# EAGLE design maho-dac (EAGLE 4.16)
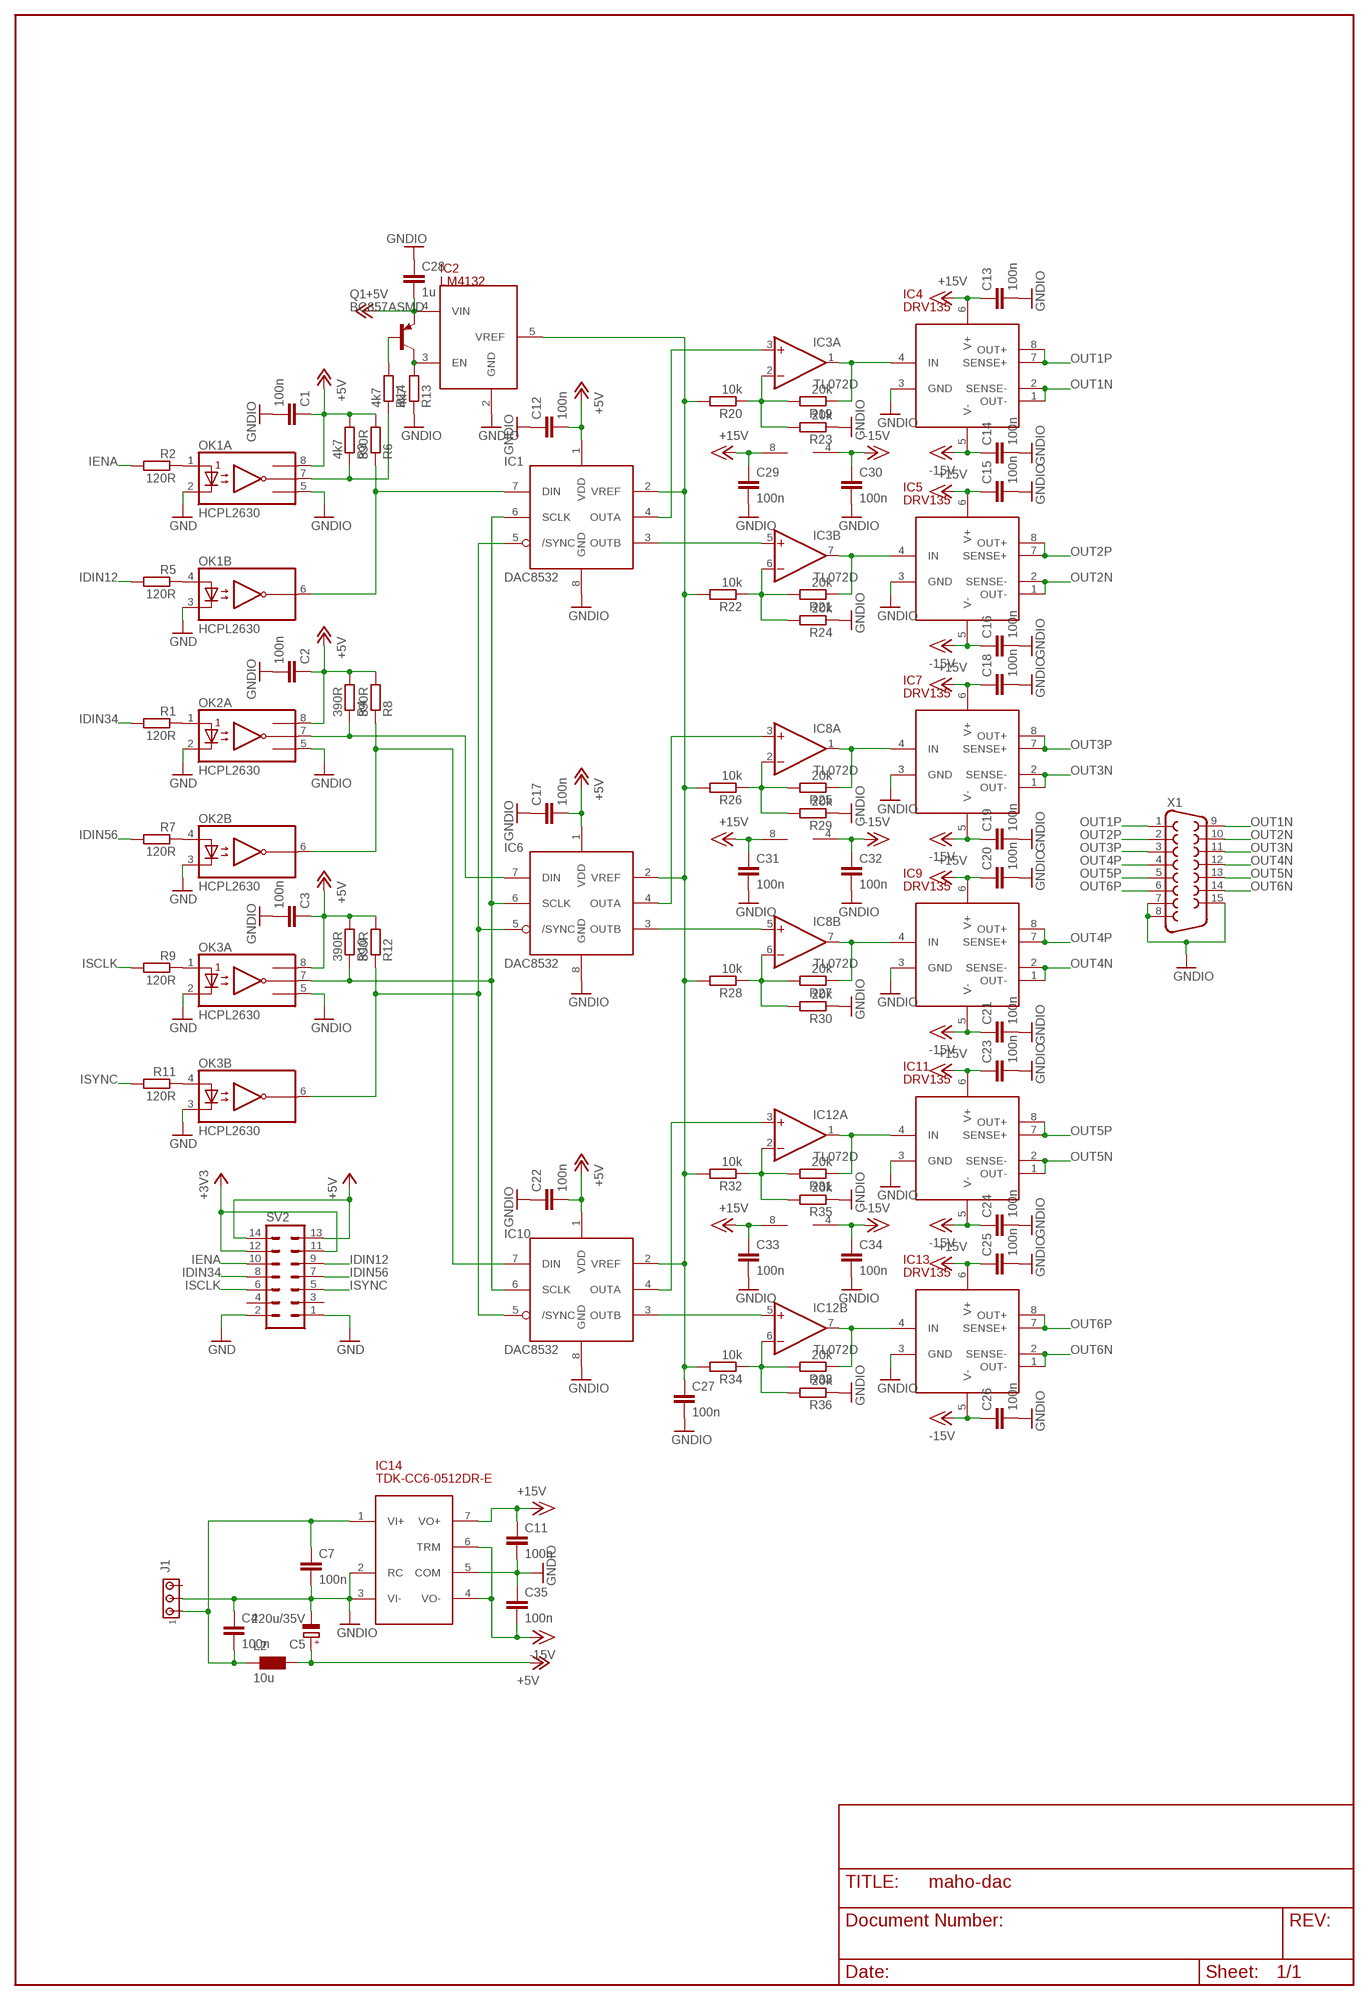
[diagram p0: schematic, sheet 1]

## Parts
C1  100n  C-EUC0603  [C0603]
C2  100n  C-EUC0603  [C0603]
C3  100n  C-EUC0603  [C0603]
C4  100n  C-EUC0603  [C0603]
C5  220u/35V  CPOL-EUF  [PANASONIC_F]
C7  100n  C-EUC0603  [C0603]
C11  100n  C-EUC0603  [C0603]
C12  100n  C-EUC0603  [C0603]
C13  100n  C-EUC0603  [C0603]
C14  100n  C-EUC0603  [C0603]
C15  100n  C-EUC0603  [C0603]
C16  100n  C-EUC0603  [C0603]
C17  100n  C-EUC0603  [C0603]
C18  100n  C-EUC0603  [C0603]
C19  100n  C-EUC0603  [C0603]
C20  100n  C-EUC0603  [C0603]
C21  100n  C-EUC0603  [C0603]
C22  100n  C-EUC0603  [C0603]
C23  100n  C-EUC0603  [C0603]
C24  100n  C-EUC0603  [C0603]
C25  100n  C-EUC0603  [C0603]
C26  100n  C-EUC0603  [C0603]
C27  100n  C-EUC0603  [C0603]
C28  1u  C-EUC0603  [C0603]
C29  100n  C-EUC0603  [C0603]
C30  100n  C-EUC0603  [C0603]
C31  100n  C-EUC0603  [C0603]
C32  100n  C-EUC0603  [C0603]
C33  100n  C-EUC0603  [C0603]
C34  100n  C-EUC0603  [C0603]
C35  100n  C-EUC0603  [C0603]
IC1  DAC8532  [MSOP8]
IC2  LM4132  [SOT23-5]
IC3  TL072D  [SO08]
IC4  DRV135  [SO08]
IC5  DRV135  [SO08]
IC6  DAC8532  [MSOP8]
IC7  DRV135  [SO08]
IC8  TL072D  [SO08]
IC9  DRV135  [SO08]
IC10  DAC8532  [MSOP8]
IC11  DRV135  [SO08]
IC12  TL072D  [SO08]
IC13  DRV135  [SO08]
IC14  TDK-CC6-0512DR-E  DCDC-TDK-CC6  [DCDC-TDK-CC6]
J1  MTA03-100  [10X03MTA]
L2  10u  WE-HC_744312...  [WE-HC_744312...]
OK1  HCPL2630  [DIL08]
OK2  HCPL2630  [DIL08]
OK3  HCPL2630  [DIL08]
Q1  BC857ASMD  [SOT23-BEC]
R1  120R  R-EU_R0805  [R0805]
R2  120R  R-EU_R0805  [R0805]
R3  4k7  R-EU_R0805  [R0805]
R4  390R  R-EU_R0805  [R0805]
R5  120R  R-EU_R0805  [R0805]
R6  390R  R-EU_R0805  [R0805]
R7  120R  R-EU_R0805  [R0805]
R8  390R  R-EU_R0805  [R0805]
R9  120R  R-EU_R0805  [R0805]
R10  390R  R-EU_R0805  [R0805]
R11  120R  R-EU_R0805  [R0805]
R12  390R  R-EU_R0805  [R0805]
R13  4k7  R-EU_R0805  [R0805]
R14  4k7  R-EU_R0805  [R0805]
R19  20k  R-EU_R0805  [R0805]
R20  10k  R-EU_R0805  [R0805]
R21  20k  R-EU_R0805  [R0805]
R22  10k  R-EU_R0805  [R0805]
R23  20k  R-EU_R0805  [R0805]
R24  20k  R-EU_R0805  [R0805]
R25  20k  R-EU_R0805  [R0805]
R26  10k  R-EU_R0805  [R0805]
R27  20k  R-EU_R0805  [R0805]
R28  10k  R-EU_R0805  [R0805]
R29  20k  R-EU_R0805  [R0805]
R30  20k  R-EU_R0805  [R0805]
R31  20k  R-EU_R0805  [R0805]
R32  10k  R-EU_R0805  [R0805]
R33  20k  R-EU_R0805  [R0805]
R34  10k  R-EU_R0805  [R0805]
R35  20k  R-EU_R0805  [R0805]
R36  20k  R-EU_R0805  [R0805]
SV2  ML14  [ML14]
X1  F15HP  [F15HP]

## Nets
+3V3: SV2.11 SV2.12
+5V: SV2.13 SV2.14
+12V: C1.1 C2.1 C3.1 C5.+ C12.2 C17.2 C22.2 C28.2 IC1.1(VDD) IC2.4(VIN) IC6.1(VDD) IC10.1(VDD) L2.2 OK1.8(A:VCC) OK2.8(A:VCC) OK3.8(A:VCC) Q1.E R3.2 R4.2 R6.2 R8.2 R10.2 R12.2 ; supply symbol labelled +5V
+15V: C11.1 C13.1 C15.1 C18.1 C20.1 C23.1 C25.1 C29.1 C31.1 C33.1 IC3.8(P:V+) IC4.6(V+) IC5.6(V+) IC7.6(V+) IC8.8(P:V+) IC9.6(V+) IC11.6(V+) IC12.8(P:V+) IC13.6(V+) IC14.7(VO+)
-15V: C14.1 C16.1 C19.1 C21.1 C24.1 C26.1 C30.1 C32.1 C34.1 C35.2 IC3.4(P:V-) IC4.5(V-) IC5.5(V-) IC7.5(V-) IC8.4(P:V-) IC9.5(V-) IC11.5(V-) IC12.4(P:V-) IC13.5(V-) IC14.4(VO-) IC14.6(TRM)
GND: OK1.2(A:C1) OK1.3(B:C2) OK2.2(A:C1) OK2.3(B:C2) OK3.2(A:C1) OK3.3(B:C2) SV2.1 SV2.2
GNDIO: C1.2 C2.2 C3.2 C4.1 C5.- C7.2 C11.2 C12.1 C13.2 C14.2 C15.2 C16.2 C17.1 C18.2 C19.2 C20.2 C21.2 C22.1 C23.2 C24.2 C25.2 C26.2 C27.2 C28.1 C29.2 C30.2 C31.2 C32.2 C33.2 C34.2 C35.1 IC1.8(GND) IC2.2(GND) IC4.3(GND) IC5.3(GND) IC6.8(GND) IC7.3(GND) IC9.3(GND) IC10.8(GND) IC11.3(GND) IC13.3(GND) IC14.2(RC) IC14.3(VI-) IC14.5(COM) J1.2 OK1.5(A:GND) OK2.5(A:GND) OK3.5(A:GND) R13.1 R23.1 R24.1 R29.1 R30.1 R35.1 R36.1 X1.7 X1.8 X1.15
IDIN12: R5.2 SV2.9
IDIN34: R1.2 SV2.8
IDIN56: R7.2 SV2.7
IENA: R2.2 SV2.10
ISCLK: R9.2 SV2.6
ISYNC: R11.2 SV2.5
N$1: IC1.7(DIN) OK1.6(B:VO2) R6.1
N$2: OK1.7(A:VO1) R3.1 R14.1
N$3: OK1.4(B:A2) R5.1
N$4: OK1.1(A:A1) R2.1
N$5: OK2.4(B:A2) R7.1
N$6: OK2.1(A:A1) R1.1
N$7: C4.2 C7.1 IC14.1(VI+) J1.1 L2.1
N$8: IC1.4(OUTA) IC3.3(A:+IN)
N$9: IC1.3(OUTB) IC3.5(B:+IN)
N$10: IC3.2(A:-IN) R19.2 R20.1 R23.2
N$11: IC3.1(A:OUT) IC4.4(IN) R19.1
N$12: C27.1 IC1.2(VREF) IC2.5(VREF) IC6.2(VREF) IC10.2(VREF) R20.2 R22.2 R26.2 R28.2 R32.2 R34.2
N$13: IC3.6(B:-IN) R21.2 R22.1 R24.2
N$14: IC3.7(B:OUT) IC5.4(IN) R21.1
N$17: IC10.7(DIN) OK2.6(B:VO2) R8.1
N$18: IC6.4(OUTA) IC8.3(A:+IN)
N$19: IC6.7(DIN) OK2.7(A:VO1) R4.1
N$20: OK3.4(B:A2) R11.1
N$21: IC6.3(OUTB) IC8.5(B:+IN)
N$22: IC8.2(A:-IN) R25.2 R26.1 R29.2
N$23: IC7.4(IN) IC8.1(A:OUT) R25.1
N$24: IC2.3(EN) Q1.C R13.2
N$25: IC8.6(B:-IN) R27.2 R28.1 R30.2
N$26: IC8.7(B:OUT) IC9.4(IN) R27.1
N$27: OK3.1(A:A1) R9.1
N$28: IC1.5(/SYNC) IC6.5(/SYNC) IC10.5(/SYNC) OK3.6(B:VO2) R12.1
N$29: IC1.6(SCLK) IC6.6(SCLK) IC10.6(SCLK) OK3.7(A:VO1) R10.1
N$30: Q1.B R14.2
N$31: IC10.4(OUTA) IC12.3(A:+IN)
N$32: IC10.3(OUTB) IC12.5(B:+IN)
N$33: IC12.2(A:-IN) R31.2 R32.1 R35.2
N$34: IC11.4(IN) IC12.1(A:OUT) R31.1
N$36: IC12.6(B:-IN) R33.2 R34.1 R36.2
N$37: IC12.7(B:OUT) IC13.4(IN) R33.1
OUT1N: IC4.1(OUT-) IC4.2(SENSE-) X1.9
OUT1P: IC4.7(SENSE+) IC4.8(OUT+) X1.1
OUT2N: IC5.1(OUT-) IC5.2(SENSE-) X1.10
OUT2P: IC5.7(SENSE+) IC5.8(OUT+) X1.2
OUT3N: IC7.1(OUT-) IC7.2(SENSE-) X1.11
OUT3P: IC7.7(SENSE+) IC7.8(OUT+) X1.3
OUT4N: IC9.1(OUT-) IC9.2(SENSE-) X1.12
OUT4P: IC9.7(SENSE+) IC9.8(OUT+) X1.4
OUT5N: IC11.1(OUT-) IC11.2(SENSE-) X1.13
OUT5P: IC11.7(SENSE+) IC11.8(OUT+) X1.5
OUT6N: IC13.1(OUT-) IC13.2(SENSE-) X1.14
OUT6P: IC13.7(SENSE+) IC13.8(OUT+) X1.6
Unconnected: J1.3 SV2.3 SV2.4

## Library data of the parts
C1-C4 C7 C11-C35 = rcl:C-EU: CAPACITOR, European symbol
C5 = rcl:CPOL-EU: POLARIZED CAPACITOR, European symbol
IC1 IC6 IC10 = sascha_adda:DAC8532
IC2 = sascha_adda:LM4132
IC3 IC8 IC12 = linear:TL072: OP AMP
IC4 IC5 IC7 IC9 IC11 IC13 = sascha_misc:DRV135
IC14 = sascha_misc:DCDC-TDK-CC6
J1 = con-amp:MTA03-100: AMP connector
L2 = wuerth-elektronik:WE-HC: SMD-Flat Wire Inductors WE-HC HIGH CURRENT Lower losses and no thermal aging because of the new advanced core material Superflux 200 - Flat wire coil for lower losses at high frequency ranges - Low leakage field - Extremely low profile design - Current loading up to 30 A -- Graphic cards -- Laptops -- Motherboards -- High current switching regulators -- Automotive electronics
OK1-OK3 = optocoupler:HCPL2630: HEWLETT PACKARD OPTO COUPLER
Q1 = transistor-pnp:BC857*: PNP Transistror
R1-R14 R19-R36 = rcl:R-EU_: RESISTOR, European symbol
SV2 = con-harting-ml:ML14: HARTING
X1 = con-subd:F15: SUB-D

## Board
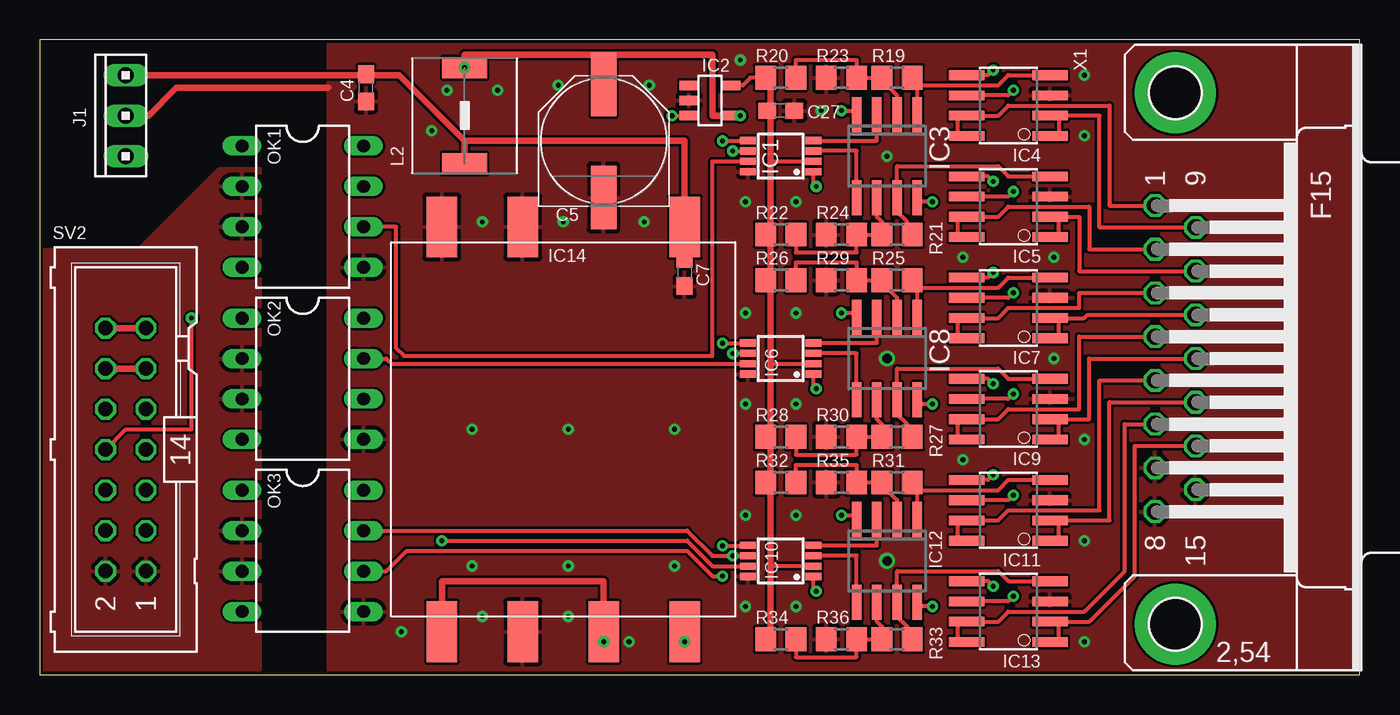
[diagram p1: board, top side]
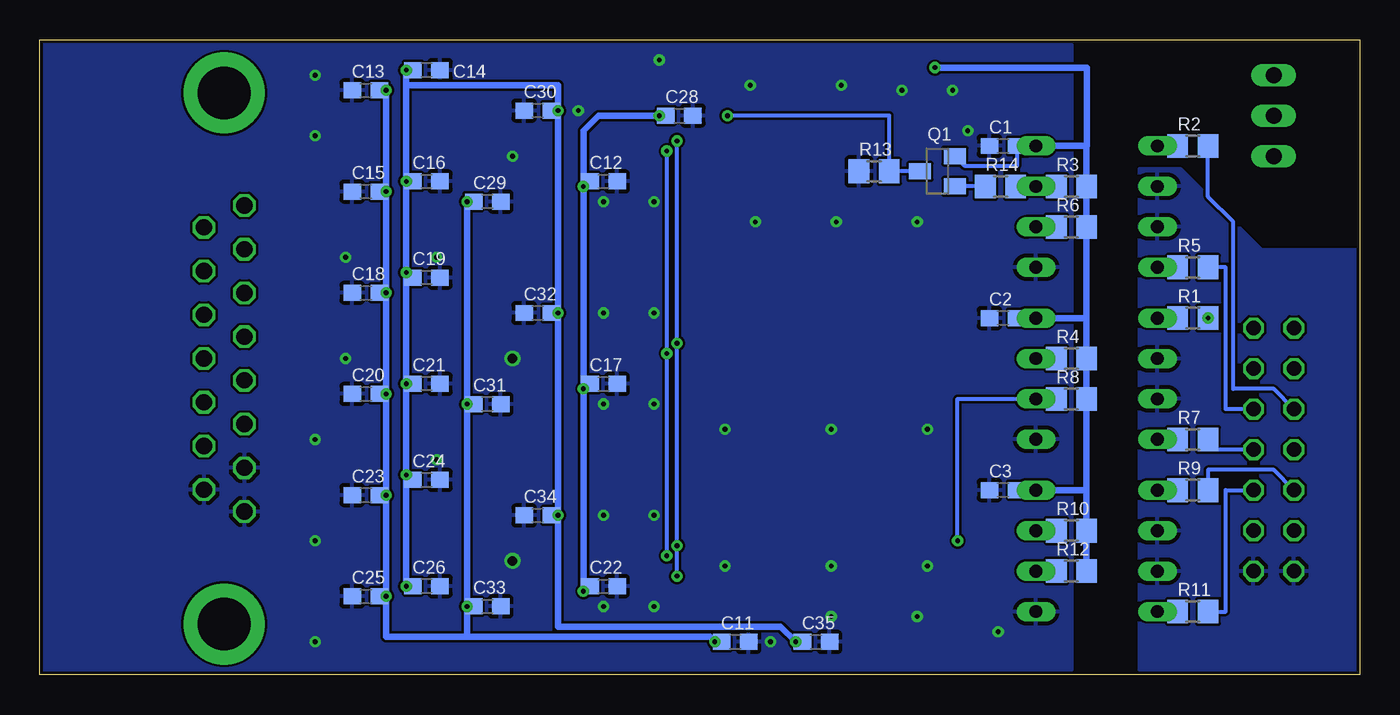
[diagram p2: board, bottom side, seen from below]

Size 82.85 x 39.83 mm. Coordinates in mm from the lower left corner, seen from the top.
Outline: 0,0 82.85,0 82.85,39.83 0,39.83 0,0
Copper layers (1+2*15+16): Top 0.035mm / dielectric 0.15mm / Route2 0.018mm / dielectric 1.5mm / Route15 0.018mm / dielectric 0.15mm / Bottom 0.035mm
Design rules "eurocircuits_class5": minimum track width 0.15mm, minimum drill 0.2mm, track to track 0.15mm, track to pad 0.15mm, pad to pad 0.15mm, via to via 0.15mm, smd to smd 0mil, copper to edge 0.2mm, drill to drill 0.2mm, minimum pad ring 0.2mm, minimum via ring 0.2mm, stop-mask expansion 4mil, vias tented up to drill 0mil, thermal gap 10mil

### Footprints (pad centres in the part's own frame; a part is rotated, then mirrored left to right if it is on the bottom)
C0603 = smd 1.1 x 1: 1 -0.85,0; 2 0.85,0
PANASONIC_F = smd 4 x 1.6: + 3.55,0; - -3.55,0
MSOP8 = smd 0.45 x 1: 1 -0.975,-2.05; 2 -0.325,-2.05; 3 0.325,-2.05; 4 0.975,-2.05; 5 0.975,2.05; 6 0.325,2.05; 7 -0.325,2.05; 8 -0.975,2.05
SOT23-5 = smd 0.6 x 1.2: 1 -0.95,-1.306; 2 0,-1.306; 3 0.95,-1.306; 4 0.95,1.306; 5 -0.95,1.306
SO08 = smd 0.6 x 2.2: 1 -1.905,-2.6; 2 -0.635,-2.6; 3 0.635,-2.6; 4 1.905,-2.6; 5 1.905,2.6; 6 0.635,2.6; 7 -0.635,2.6; 8 -1.905,2.6
SO08' = smd 0.61 x 2.21: 1 -1.905,-2.616; 2 -0.635,-2.616; 3 0.635,-2.616; 4 1.905,-2.616; 5 1.905,2.616; 6 0.635,2.616; 7 -0.635,2.616; 8 -1.905,2.616
DCDC-TDK-CC6 = smd 3.81 x 1.93: 1 -12.7,7.62; 2 -12.7,-2.54; 3 -12.7,-7.62; 4 12.7,-7.62; 5 12.7,-2.54; 6 12.7,2.54; 7 12.7,7.62
10X03MTA = drill 1.016 long: 1 2.54,0; 2 0,0; 3 -2.54,0
WE-HC_744312... = smd 1.3 x 2.8: 1 -3,0; 2 3,0
DIL08 = drill 0.813 long: 1 -3.81,-3.81; 2 -1.27,-3.81; 3 1.27,-3.81; 4 3.81,-3.81; 5 3.81,3.81; 6 1.27,3.81; 7 -1.27,3.81; 8 -3.81,3.81
SOT23-BEC = smd 1 x 1.4: B -0.95,-1.1; C 0,1.1; E 0.95,-1.1
R0805 = smd 1.3 x 1.5: 1 -0.95,0; 2 0.95,0
ML14 = drill 0.914 octagon: 1 -7.62,-1.27; 2 -7.62,1.27; 3 -5.08,-1.27; 4 -5.08,1.27; 5 -2.54,-1.27; 6 -2.54,1.27; 7 0,-1.27; 8 0,1.27; 9 2.54,-1.27; 10 2.54,1.27; 11 5.08,-1.27; 12 5.08,1.27; 13 7.62,-1.27; 14 7.62,1.27
F15HP = drill 1.016 octagon: 1 -9.601,-1.27; 2 -6.858,-1.27; 3 -4.115,-1.27; 4 -1.372,-1.27; 5 1.372,-1.27; 6 4.115,-1.27; 7 6.858,-1.27; 8 9.601,-1.27; 9 -8.23,1.27; 10 -5.486,1.27; 11 -2.743,1.27; 12 0,1.27; 13 2.743,1.27; 14 5.486,1.27; 15 8.23,1.27 | drill 3.302 pad 5.08 round: G1 -16.662,0; G2 16.662,0

### Placement (x,y rotation side)
C1  22.38,33.17 180 bottom
C2  22.38,22.38 180 bottom
C3  22.38,11.58 180 bottom
C4  20.47,36.82 90 top
C5  35.4,33.49 90 top
C7  40.48,25.23 270 top
C11  39.21,2.06 0 bottom
C12  47.46,30.95 180 bottom
C13  62.38,36.67 180 bottom
C14  58.57,37.94 0 bottom
C15  62.38,30.32 180 bottom
C16  58.57,30.95 0 bottom
C17  47.46,18.25 180 bottom
C18  62.38,23.96 180 bottom
C19  58.57,24.92 0 bottom
C20  62.38,17.61 180 bottom
C21  58.57,18.25 0 bottom
C22  47.46,5.55 180 bottom
C23  62.38,11.27 180 bottom
C24  58.57,12.22 0 bottom
C25  62.38,4.92 180 bottom
C26  58.57,5.55 0 bottom
C27  46.51,35.4 0 top
C28  42.7,35.08 180 bottom
C29  54.76,29.68 0 bottom
C30  51.59,35.4 180 bottom
C31  54.76,16.98 0 bottom
C32  51.59,22.7 180 bottom
C33  54.76,4.28 0 bottom
C34  51.59,9.99 180 bottom
C35  34.13,2.06 180 bottom
IC1  46.51,32.54 90 top
IC2  42.06,36.03 270 top
IC3  53.18,32.54 180 top
IC4  DRV135  [SO08']  60.8,35.71 90 top
IC5  DRV135  [SO08']  60.8,29.36 90 top
IC6  46.51,19.84 90 top
IC7  DRV135  [SO08']  60.8,23.01 90 top
IC8  53.18,19.84 180 top
IC9  DRV135  [SO08']  60.8,16.66 90 top
IC10  46.51,7.14 90 top
IC11  DRV135  [SO08']  60.8,10.31 90 top
IC12  53.18,7.14 180 top
IC13  DRV135  [SO08']  60.8,3.96 90 top
IC14  32.86,15.39 270 top
J1  5.39,35.08 90 top
L2  26.66,35.08 90 top
OK1  16.5,29.36 270 top
OK2  16.5,18.57 270 top
OK3  16.51,7.77 270 top
Q1  26.51,31.58 90 bottom
R1  10.47,22.38 0 bottom
R2  10.47,33.17 0 bottom
R3  18.09,30.63 0 bottom
R4  18.09,19.84 0 bottom
R5  10.47,25.55 0 bottom
R6  18.09,28.09 0 bottom
R7  10.47,14.76 0 bottom
R8  18.09,17.3 0 bottom
R9  10.47,11.58 0 bottom
R10  18.09,9.04 0 bottom
R11  10.47,3.96 0 bottom
R12  18.09,6.5 0 bottom
R13  30.48,31.59 0 bottom
R14  22.54,30.63 180 bottom
R19  53.81,37.46 180 top
R20  46.51,37.46 180 top
R21  53.81,27.62 180 top
R22  46.51,27.62 180 top
R23  50.32,37.46 0 top
R24  50.32,27.62 0 top
R25  53.81,24.76 180 top
R26  46.51,24.76 180 top
R27  53.81,14.92 180 top
R28  46.51,14.92 180 top
R29  50.32,24.76 0 top
R30  50.32,14.92 0 top
R31  53.81,12.06 180 top
R32  46.51,12.06 180 top
R33  53.81,2.22 180 top
R34  46.51,2.22 180 top
R35  50.32,12.06 0 top
R36  50.32,2.22 0 top
SV2  5.39,14.12 90 top
X1  71.27,19.84 270 top

### Tracks (layer width: path | path; a pad name or v marks a point on that pad's centre or on a via)
+3V3
  Top 0.406: SV2.12 | SV2.12 SV2.11 | SV2.12
+5V
  Top 0.406: SV2.13 | SV2.14 SV2.13 | SV2.13
+12V  (via drill 0.3)
  Top 0.254: IC2.4 v43.97,35.08 | IC1.1 48.56,30.8 v48.73,30.63 | IC6.1 48.56,18.11 v48.73,17.93 | IC10.1 48.56,5.41 v48.73,5.23
  Top 0.406: IC2.4 42.22,35.08 42.22,38.89 35.4,38.89 | L2.2 | 35.4,38.89 26.66,38.89 v26.66,38.09 L2.2 | 35.4,38.89 C5.+
  Bottom 0.254: Q1.E 24.77,31.9 21.53,31.9 C1.1
  Bottom 0.406: v48.73,17.93 v48.73,5.23 48.73,5.55 C22.2 | v48.73,30.63 v48.73,17.93 | v48.73,30.63 48.73,34.12 47.78,35.08 v43.97,35.08 C28.2 | C12.2 48.73,30.95 v48.73,30.63 | C17.2 48.73,18.25 v48.73,17.93 | C3.1 OK3.8 17.14,11.58 | R10.2 | R10.2 | R12.2 R10.2 | R10.2 | R10.2 17.14,11.58 | R8.2 | R8.2 | 17.14,11.58 R8.2 | R8.2 | 17.14,19.68 | 17.14,19.68 R4.2 17.14,22.38 | R8.2 17.14,19.68 | 17.14,19.68 | OK2.8 | OK2.8 | 17.14,22.38 OK2.8 | R6.2 | 17.14,22.38 R6.2 | R6.2 | R3.2 | R6.2 R3.2 | R3.2 | R3.2 17.14,33.17 | 17.14,33.17 OK1.8 C1.1 | C1.1 | v26.66,38.09 17.14,38.09 17.14,33.17 | OK2.8 | OK2.8 C2.1
+15V  (via drill 0.3)
  Top 0.254: IC4.6 60.8,36.35 v61.11,36.67 | IC5.6 60.8,30 v61.11,30.32 | IC7.6 60.8,23.65 v61.11,23.96 | IC9.6 60.8,17.3 v61.11,17.61 | IC11.6 60.8,10.95 v61.11,11.27 | IC13.6 60.8,4.6 v61.11,4.92 | IC12.8 55.08,4.28 v56.03,4.28 | IC8.8 55.08,16.98 v56.03,16.98 | IC3.8 55.08,29.68 v56.03,29.68
  Top 0.406: v40.48,2.06 IC14.7
  Bottom 0.406: v61.11,4.92 v61.11,11.27 | v61.11,11.27 v61.11,17.61 | v61.11,17.61 v61.11,23.96 | v61.11,23.96 v61.11,30.32 | v61.11,30.32 v61.11,36.67 C13.1 | v61.11,4.92 61.11,2.38 56.03,2.38 | 56.03,2.38 v56.03,4.28 | v56.03,4.28 v56.03,16.98 | v56.03,16.98 v56.03,29.68 C29.1 | v61.11,30.32 C15.1 | v61.11,23.96 C18.1 | v61.11,17.61 C20.1 | v61.11,11.27 C23.1 | v61.11,4.92 C25.1 | v56.03,4.28 C33.1 | v56.03,16.98 C31.1 | 56.03,2.38 40.79,2.38 v40.48,2.06 C11.1
-15V  (via drill 0.3)
  Top 0.254: IC4.5 59.53,37.62 v59.84,37.93 | IC5.5 59.53,31.27 v59.84,30.95 | IC7.5 59.53,24.92 v59.84,25.23 | IC9.5 59.53,18.57 v59.84,18.25 | IC11.5 59.53,12.22 v59.84,12.54 | IC13.5 59.53,5.87 v59.84,5.55 | IC12.4 51.27,9.99 v50.32,9.99 | IC8.4 51.27,22.7 v50.32,22.7 | IC3.4 51.27,35.39 v50.32,35.39
  Top 0.406: IC14.4 25.24,5.87 35.4,5.87 IC14.6 v35.4,2.06
  Bottom 0.406: v59.84,12.54 v59.84,5.55 C26.1 | v59.84,18.25 v59.84,12.54 | v59.84,25.23 v59.84,18.25 | v59.84,30.95 v59.84,25.23 | 59.84,36.98 v59.84,30.95 | v50.32,22.7 v50.32,35.39 | v50.32,9.99 v50.32,22.7 | C24.1 59.84,12.22 v59.84,12.54 | v59.84,18.25 C21.1 | C19.1 59.84,24.92 v59.84,25.23 | v59.84,30.95 C16.1 | v50.32,35.39 50.32,36.98 59.84,36.98 | 59.84,36.98 v59.84,37.93 C14.1 | v50.32,35.39 C30.1 | v50.32,22.7 C32.1 | v50.32,9.99 C34.1 | v50.32,9.99 50.32,3.01 36.35,3.01 v35.4,2.06 C35.2
GND
  pour Bottom: 0.15,0.31 13.81,0.31 13.81,31.74 11.27,31.74 6.19,26.66 0.15,26.66
  pour Top: 13.81,0.31 0.15,0.31 0.15,26.66 6.19,26.66 11.27,31.74 13.81,31.74
GNDIO  (via drill 0.3, 0.6)
  Top 0.406: J1.2 6.82,35.08 8.57,36.82 18.09,36.82
  other vias: 57.94,26.19 57.94,13.49 53.18,7.14 53.18,19.84 53.18,32.54 65.56,33.81 63.65,26.19 63.65,19.84 65.56,14.76 65.56,8.41 65.56,2.06 65.56,37.62 47.46,9.99 47.46,4.28 47.46,16.98 47.46,22.7 47.46,29.68 49.05,35.4 32.86,28.41 37.94,28.41 32.54,36.98 38.25,36.98 28.73,36.67 24.6,34.12 25.55,36.67 27.78,28.41 33.17,15.39 27.14,15.39 39.84,15.39 33.17,6.82 27.14,6.82 39.84,6.82 27.78,3.65 22.7,2.69 36.98,2.06 33.17,3.65 44.29,22.7 44.29,16.98 44.29,9.99 44.29,4.28 44.29,29.68 43.97,38.57
  pour Top: 18.09,39.52 18.09,0.31 82.7,0.31 82.7,39.52
  pour Bottom: 18.09,39.52 18.09,0.31 82.7,0.31 82.7,39.52
IDIN12
  Bottom 0.254: SV2.9 8.41,16.66 8.41,25.55 R5.2
IDIN34  (via drill 0.3)
  Top 0.254: SV2.8 | SV2.8 5.39,15.39 9.52,15.39 R1.2
  Bottom 0.254: R1.2 | R1.2
  other vias: 9.52,22.38
IDIN56
  Bottom 0.254: SV2.7 | R7.2 8.89,14.12 SV2.7
IENA
  Bottom 0.254: SV2.10 | SV2.10 5.39,17.93 7.93,17.93 7.93,28.41 9.52,30 R2.2
ISCLK
  Bottom 0.254: R9.2 9.52,12.85 5.39,12.85 SV2.6 | SV2.6
ISYNC
  Bottom 0.254: SV2.5 | SV2.5 8.41,11.58 8.41,3.96 R11.2
N$1
  Top 0.254: OK1.6 22.38,28.09 22.38,20.47 22.85,20 42.22,20 42.22,32.21 IC1.7
  Bottom 0.254: OK1.6 | R6.1 | OK1.6 R6.1
N$2
  Bottom 0.254: R3.1 OK1.7
  Bottom 0.406: OK1.7 R14.1
N$3
  Bottom 0.254: OK1.4 | R5.1 OK1.4
N$4
  Bottom 0.254: OK1.1 | R2.1 OK1.1
N$5
  Bottom 0.254: OK2.4 | OK2.4 | R7.1 OK2.4
N$6
  Bottom 0.254: OK2.1 | R1.1 OK2.1 | OK2.1
N$7
  Top 0.406: 26.66,33.49 40.48,33.49 IC14.1 C7.1 | 26.66,33.49 22.54,37.62 20.47,37.62 | 20.47,37.62 C4.2 | J1.1 20.47,37.62 | L2.1 | 26.66,33.49 L2.1
N$8
  Top 0.254: IC1.4 52.54,33.51 IC3.3
N$9
  Top 0.254: IC1.3 51.27,32.86 IC3.5
N$10
  Top 0.254: IC3.2 53.81,36.35 52.86,37.3 R19.2 R23.2 51.27,38.57 47.46,38.57 R20.1
N$11
  Top 0.254: IC4.4 60.8,37.62 60.16,36.98 55.08,36.98 | IC3.1 55.08,36.98 | R19.1 55.08,37.46 55.08,36.98
N$12
  Top 0.254: IC10.2 45.87,6.82 | IC6.2 45.87,19.52 | IC1.2 45.87,32.22 | IC2.5 44.12,36.98 44.6,37.46 R20.2
  Top 0.406: R20.2 45.87,37.46 45.87,35.39 | R34.2 45.87,2.22 45.87,6.82 45.87,12.06 | 45.87,12.06 45.87,14.92 | 45.87,14.92 45.87,19.52 45.87,24.76 | 45.87,24.76 45.87,27.62 | 45.87,27.62 45.87,32.22 45.87,35.39 | 45.87,35.39 C27.1 | 45.87,27.62 R22.2 | 45.87,24.76 R26.2 | 45.87,14.92 R28.2 | 45.87,14.92 | 45.87,12.06 R32.2
N$13
  Top 0.254: IC3.6 52.54,28.73 52.86,28.41 R21.2 R24.2 51.27,26.5 47.46,26.5 R22.1
N$14
  Top 0.254: IC5.4 60.8,31.27 60.16,31.9 53.81,31.9 IC3.7 53.81,29.04 54.45,28.41 54.45,27.62 R21.1
N$17  (via drill 0.3)
  Top 0.254: IC10.7 42.23,6.81 40.63,8.41 v25.24,8.41
  Bottom 0.254: R8.1 | OK2.6 R8.1 | OK2.6 | v25.24,8.41 25.24,17.3 OK2.6
N$18
  Top 0.254: IC6.4 52.54,20.81 IC8.3
N$19
  Top 0.254: IC6.7 22.07,19.51 21.74,19.84 OK2.7 | OK2.7
  Bottom 0.254: OK2.7 | OK2.7 | R4.1 | R4.1 OK2.7
N$20
  Bottom 0.254: R11.1 OK3.4
N$21
  Top 0.254: IC6.3 51.27,20.16 IC8.5
N$22
  Top 0.254: IC8.2 53.81,23.65 52.86,24.6 R25.2 R29.2 51.27,25.87 47.46,25.87 R26.1
N$23
  Top 0.254: IC7.4 60.8,24.92 60.16,24.28 55.08,24.28 | IC8.1 55.08,24.28 | R25.1 55.08,24.76 55.08,24.28
N$24  (via drill 0.3)
  Top 0.254: IC2.3 v39.68,35.08
  Bottom 0.254: Q1.C R13.2 | R13.2 | v39.68,35.08 29.52,35.08 R13.2
N$25
  Top 0.254: IC8.6 52.54,16.03 52.86,15.71 R27.2 R30.2 51.27,13.8 47.46,13.8 R28.1
N$26
  Top 0.254: IC9.4 60.8,18.57 60.16,19.2 53.81,19.2 IC8.7 53.81,16.34 54.45,15.71 54.45,14.92 R27.1
N$27
  Bottom 0.254: R9.1 OK3.1
N$28  (via drill 0.3)
  Top 0.254: IC1.5 44.44,33.49 v42.86,33.49 | IC10.5 44.44,8.09 v42.86,8.09 | IC6.5 44.44,20.79 v42.86,20.79 | v42.86,6.18 42.22,6.18 40.63,7.77 23.01,7.77 21.74,6.5 OK3.6 | OK3.6
  Bottom 0.254: R12.1 | OK3.6 R12.1 | v42.86,33.49 v42.86,20.79 v42.86,8.09 v42.86,6.18
N$29  (via drill 0.3)
  Top 0.254: IC10.6 v43.49,7.46 42.22,7.46 40.63,9.04 OK3.7 | OK3.7 | IC1.6 v43.49,32.86 | IC6.6 v43.49,20.16
  Bottom 0.254: R10.1 | R10.1 OK3.7 | v43.49,7.46 v43.49,20.16 v43.49,32.86
N$30
  Bottom 0.254: Q1.B 25.24,30.63 R14.2
N$31
  Top 0.254: IC10.4 52.54,8.11 IC12.3
N$32
  Top 0.254: IC10.3 51.27,7.46 IC12.5
N$33
  Top 0.254: IC12.2 53.81,10.95 52.86,11.9 R31.2 R35.2 51.27,13.17 47.46,13.17 R32.1
N$34
  Top 0.254: IC11.4 60.8,12.22 60.16,11.58 55.08,11.58 | IC12.1 55.08,11.58 | R31.1 55.08,12.06 55.08,11.58
N$36
  Top 0.254: IC12.6 52.54,3.33 52.86,3.01 R33.2 R36.2 51.27,1.11 47.46,1.11 R34.1
N$37
  Top 0.254: IC13.4 60.8,5.87 60.16,6.5 53.81,6.5 IC12.7 53.81,3.65 54.45,3.01 54.45,2.22 R33.1
OUT1N
  Top 0.254: 63.97,35.08 IC4.2 | 63.97,35.08 63.97,33.81 IC4.1 | X1.9 66.51,28.07 66.51,35.08 63.97,35.08
OUT1P
  Top 0.254: IC4.8 57.62,33.81 57.62,35.08 IC4.7 60.16,35.08 60.8,35.71 67.15,35.71 67.15,29.44 X1.1
OUT2N
  Top 0.254: 63.97,28.73 IC5.2 | 63.97,28.73 63.97,27.46 IC5.1 | 63.97,28.73 65.24,28.73 65.24,25.32 X1.10
OUT2P
  Top 0.254: IC5.8 57.62,27.46 57.62,28.73 IC5.7 60.16,28.73 60.8,29.36 65.88,29.36 65.88,26.7 X1.2
OUT3N
  Top 0.254: 63.97,22.38 IC7.2 | 63.97,22.38 63.97,21.11 IC7.1 | 63.97,22.38 65.56,22.38 65.76,22.58 X1.11
OUT3P
  Top 0.254: IC7.8 57.62,21.11 57.62,22.38 IC7.7 60.16,22.38 60.8,23.01 65.24,23.01 65.24,23.95 X1.3
OUT4N
  Top 0.254: 63.97,16.03 IC9.2 | 63.97,16.03 63.97,14.76 IC9.1 | X1.12 65.88,19.84 65.88,16.03 63.97,16.03
OUT4P
  Top 0.254: IC9.8 57.62,14.76 57.62,16.03 IC9.7 60.16,16.03 60.8,16.66 65.24,16.66 65.24,21.21 X1.4
OUT5N
  Top 0.254: 63.97,9.68 IC11.2 | 63.97,9.68 63.97,8.41 IC11.1 | X1.13 67.15,17.09 67.15,9.68 63.97,9.68
OUT5P
  Top 0.254: IC11.8 57.62,8.41 57.62,9.68 IC11.7 60.16,9.68 60.8,10.31 66.51,10.31 66.51,18.47 X1.5
OUT6N
  Top 0.254: 63.97,3.33 IC13.2 | 63.97,3.33 63.97,2.06 IC13.1 | X1.14 68.73,14.35 68.73,6.18 65.88,3.33 63.97,3.33
OUT6P
  Top 0.254: IC13.8 57.62,2.06 57.62,3.33 IC13.7 60.16,3.33 60.8,3.96 65.56,3.96 68.1,6.5 68.1,15.72 X1.6